# EAGLE design blink1mk3_micro1e (EAGLE 9.1.2)
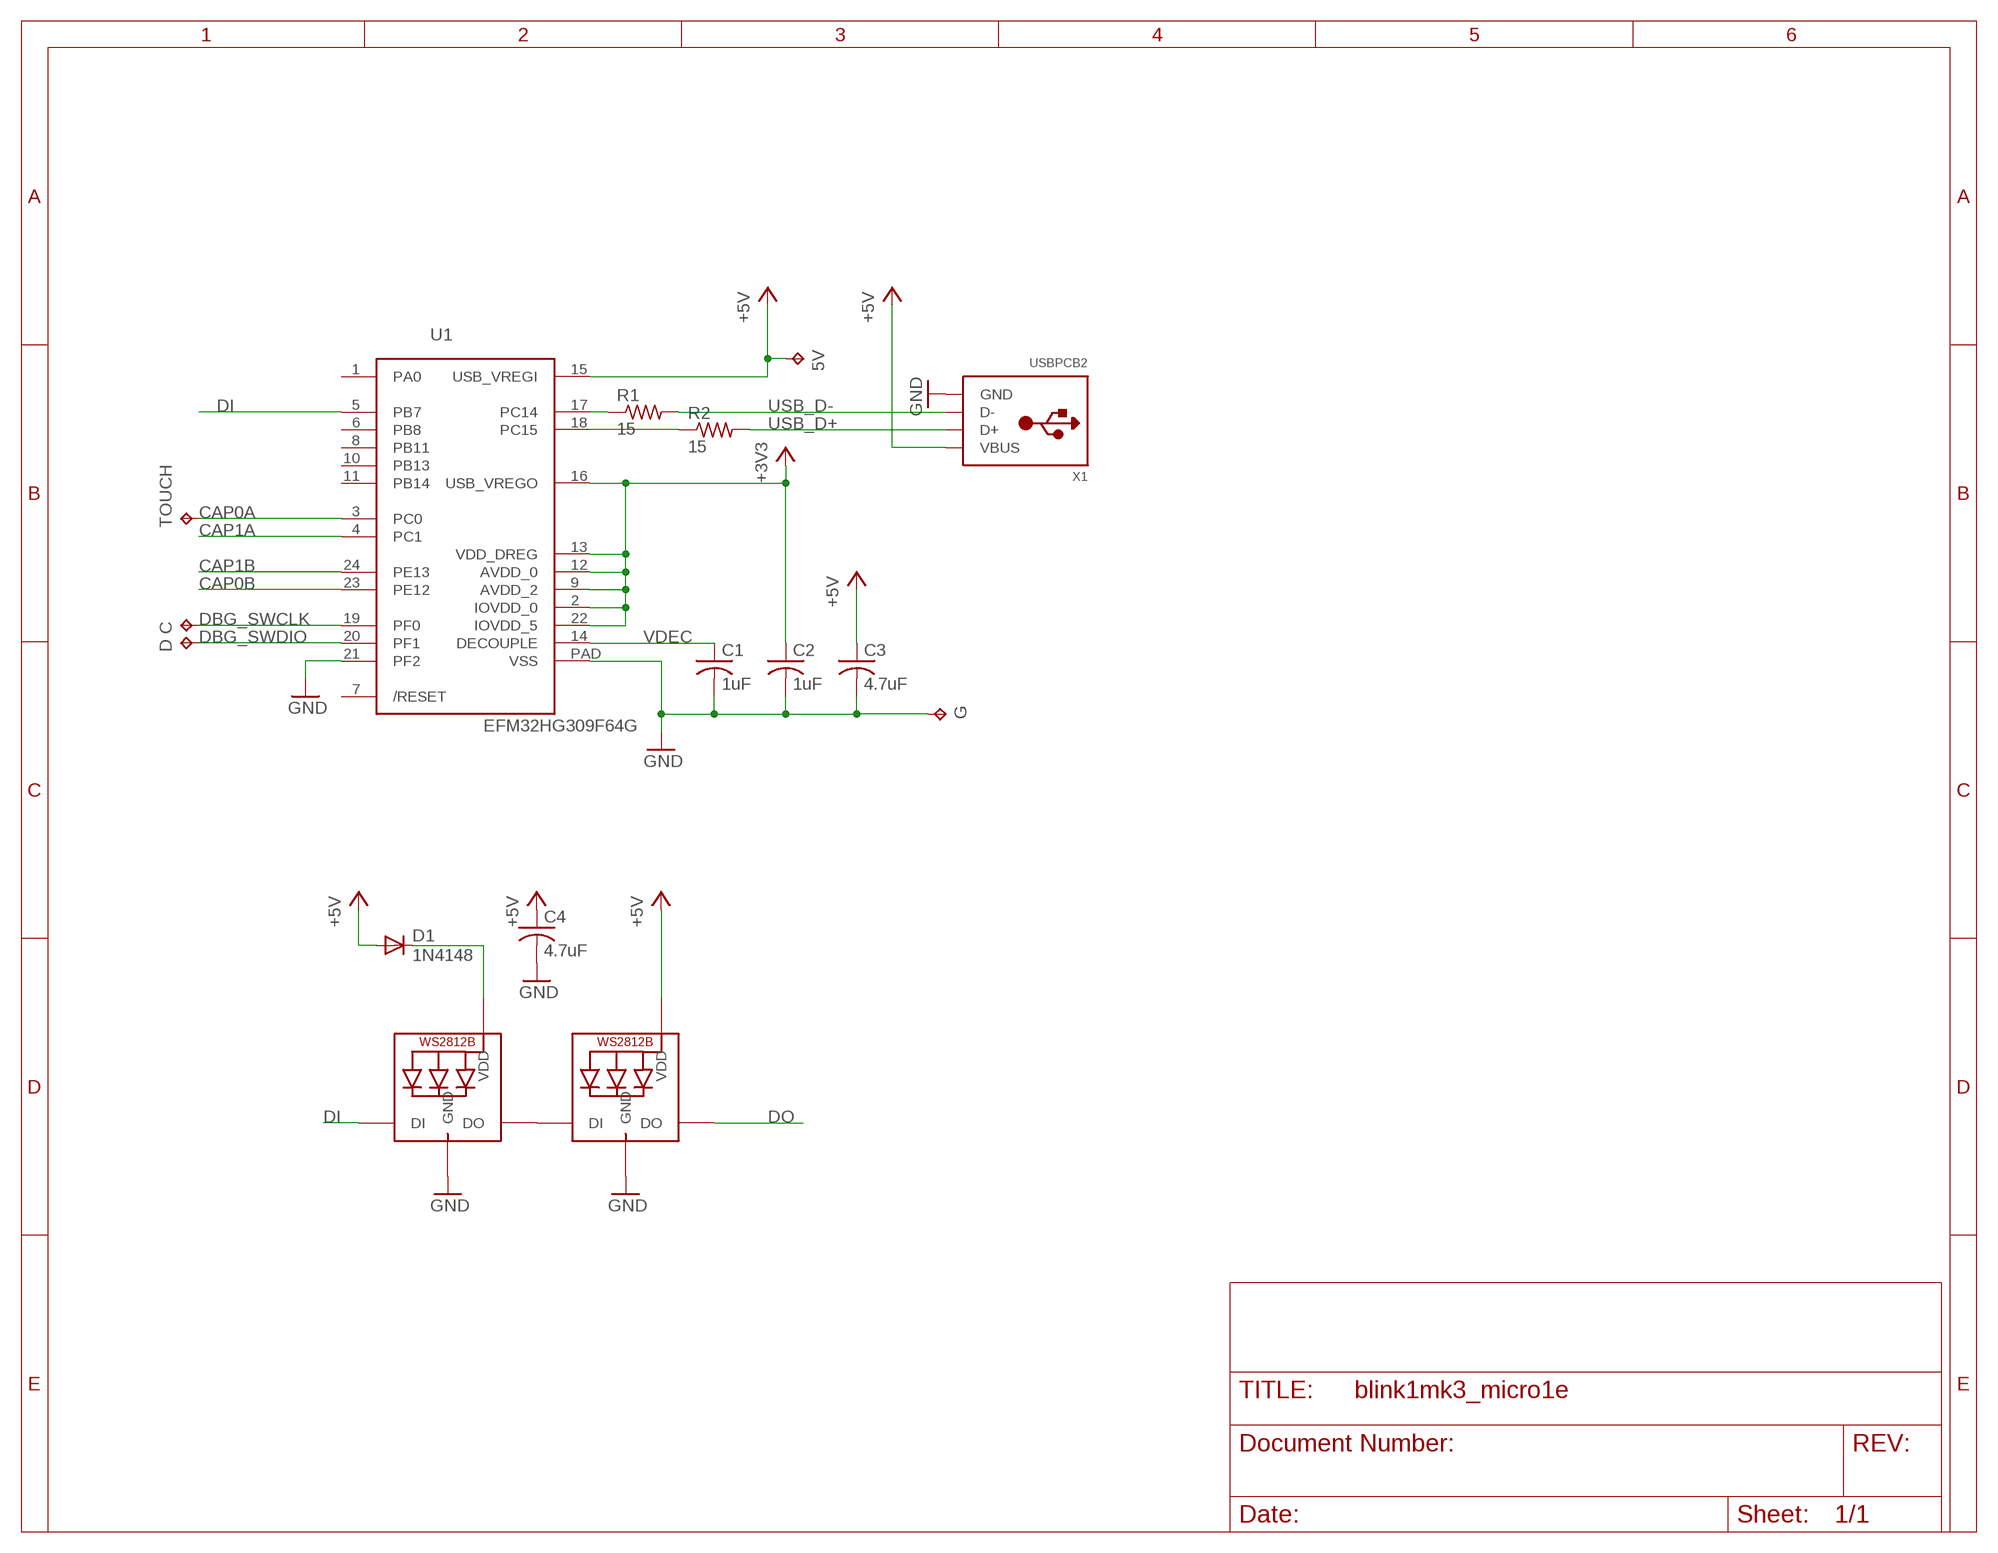
[diagram p0: schematic, sheet 1]

## Parts
5V  TPTP10R  [TP10R]
C  TPTP10R  [TP10R]
C1  1uF  C-USC0402  [C0402]
C2  1uF  C-USC0402  [C0402]
C3  4.7uF  C-USC0402  [C0402]
C4  4.7uF  C-USC0402  [C0402]
D  TPTP10R  [TP10R]
D1  1N4148  DIODE-SOD523  [SOD523]
G  TPTP10SQ  [TP10SQ]
LED1  WS2812B4020SIDE  [SK6812-SIDE]
LED2  WS2812B4020SIDE  [SK6812-SIDE]
R1  15  R-US_R0402  [R0402]
R2  15  R-US_R0402  [R0402]
TOUCH  TPTP10R  [TP10R]
U1  EFM32HG309F64G  [QFN24PAD]
X1  USBPCB2  [USB-A-PCB-2]

## Nets
+3V3: C2.1 U1.2(IOVDD_0) U1.9(AVDD_2) U1.12(AVDD_0) U1.13(VDD_DREG) U1.16(USB_VREGO) U1.22(IOVDD_5)
+5V: 5V.TP C3.1 C4.1 D1.A LED2.1-VDD(VDD) U1.15(USB_VREGI) X1.5V(VBUS)
CAP0A: TOUCH.TP U1.3(PC0)
CAP0B: U1.23(PE12)
CAP1A: U1.4(PC1)
CAP1B: U1.24(PE13)
DBG_SWCLK: C.TP U1.19(PF0)
DBG_SWDIO: D.TP U1.20(PF1)
DI: LED1.4-DIN(DI) U1.5(PB7)
DO: LED2.2-DOUT(DO)
GND: C1.2 C2.2 C3.2 C4.2 G.TP LED1.3-GND(GND) LED2.3-GND(GND) U1.21(PF2) U1.PAD(VSS) X1.GND
N$1: LED1.2-DOUT(DO) LED2.4-DIN(DI)
N$2: R1.1 U1.17(PC14)
N$3: R2.1 U1.18(PC15)
N$5: D1.C LED1.1-VDD(VDD)
USB_D+: R2.2 X1.USB_P(D+)
USB_D-: R1.2 X1.USB_M(D-)
VDEC: C1.1 U1.14(DECOUPLE)
Unconnected: U1.1(PA0) U1.6(PB8) U1.7(/RESET) U1.8(PB11) U1.10(PB13) U1.11(PB14)

## Library data of the parts
5V C D G TOUCH = testpad:TP: Test pad
C1-C4 = rcl:C-US: CAPACITOR, American symbol; SPICEPREFIX: C
D1 = diode:DIODE-: DIODE
LED1 LED2 = todstuff:WS2812B
R1 R2 = adafruit:R-US_: RESISTOR, American symbol
U1 = todstuff:EFM32HG309F64G
X1 = todstuff:USB

## Board
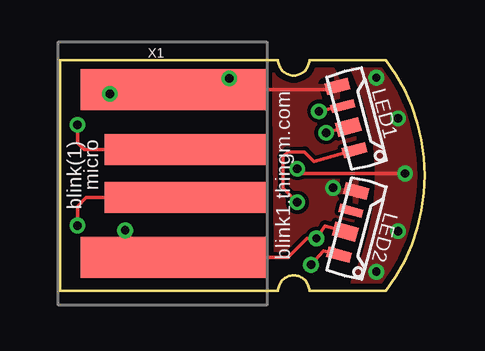
[diagram p1: board, top side]
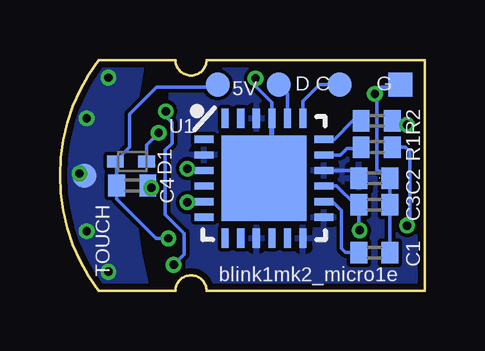
[diagram p2: board, bottom side, seen from below]

Size 15.22 x 9.64 mm. Coordinates in mm from the lower left corner, seen from the top.
Outline: 10.4,0 13.6,0 arc74 13.6,9.64 10.4,9.64 arc-180 9.1,9.64 0,9.64 0,0 9.1,0 arc-180 10.4,0
Copper layers (1*16): Top 0.035mm / dielectric 0.785mm / Bottom 0.035mm
Design rules "SeeedStudio_2layer_DRU_no_angle_20140221_blink1thin": minimum track width 6mil, minimum drill 12mil, track to track 6mil, track to pad 6mil, pad to pad 6mil, via to via 6mil, smd to smd 0mil, copper to edge 10mil, drill to drill 10mil, minimum pad ring 10mil, minimum via ring 6mil, stop-mask expansion 2mil, vias tented up to drill 100mil, thermal gap 10mil

### Footprints (pad centres in the part's own frame; a part is rotated, then mirrored left to right if it is on the bottom)
TP10R = smd 1 x 1: TP 0,0
C0402 = smd 0.7 x 0.9: 1 -0.65,0; 2 0.65,0
SOD523 = smd 0.7 x 0.5: A 0.7,0; C -0.6,0
TP10SQ = smd 1 x 1: TP 0,0
SK6812-SIDE = smd 0.6 x 1: 1-VDD 0.25,-0.45 | smd 0.35 x 1: 2-DOUT -0.65,-0.45 | smd 0.5 x 1: 3-GND -1.5,-0.45 | smd 0.45 x 1: 4-DIN 1.25,-0.45
R0402 = smd 0.7 x 0.9: 1 -0.65,0; 2 0.65,0
QFN24PAD = smd 0.8 x 0.3: 1 -2.5,1.625; 2 -2.5,0.975; 3 -2.5,0.325; 4 -2.5,-0.325; 5 -2.5,-0.975; 6 -2.5,-1.625; 13 2.5,-1.625; 14 2.5,-0.975; 15 2.5,-0.325; 16 2.5,0.325; 17 2.5,0.975; 18 2.5,1.625 | smd 0.3 x 0.8: 7 -1.625,-2.5; 8 -0.975,-2.5; 9 -0.325,-2.5; 10 0.325,-2.5; 11 0.975,-2.5; 12 1.625,-2.5; 19 1.625,2.5; 20 0.975,2.5; 21 0.325,2.5; 22 -0.325,2.5; 23 -0.975,2.5; 24 -1.625,2.5 | smd 3.55 x 3.55: PAD 0,0
USB-A-PCB-2 = smd 7.75 x 1.69: 5V -1.47,-3.5; GND -1.47,3.5 | smd 6.75 x 1.3: USB_M -0.97,-1; USB_P -0.97,1

### Placement (x,y rotation side)
5V  8.64,8.61 0 bottom
C  3.56,8.61 0 bottom
C1  2.1,1.6 0 bottom
C2  2.1,4.7 0 bottom
C3  2.1,3.6 0 bottom
C4  12.2,4.4 0 bottom
D  6.1,8.61 0 bottom
D1  12.2,5.4 180 bottom
G  1.02,8.61 0 bottom
LED1  12.4,7.2 285 top
LED2  12.4,2.6 255 top
R1  2,6 0 bottom
R2  2,7.1 0 bottom
TOUCH  14.2,4.8 270 bottom
U1  6.7,4.7 0 bottom
X1  6.2,4.9 0 top

### Tracks (layer width: path | path; a pad name or v marks a point on that pad's centre or on a via)
+3V3
  Bottom 0.152: U1.16 3.08,5.03 C2.1
  pour Bottom: -0.1,9.65 10.61,9.59 10.71,0 0,0
+5V  (via drill 0.35)
  Top 0.152: v2.72,2.53 3.55,1.4 X1.5V 9.5,1.4 10.29,2.19 v10.7,2.19 11.05,2.72 LED2.1-VDD
  Bottom 0.152: v2.72,2.53 2.75,2.46 C3.1 2.9,3.6 3.67,4.38 U1.15 | 5V.TP 8.74,8.51 11.18,8.51 12.3,7.39 12.3,6 D1.A 12.85,5.35 C4.1 12.85,3.83 11.21,2.19 v10.7,2.19
CAP0A  (via drill 0.35)
  Top 0.152: v9.9,5.1 10.1,4.9 v14.4,4.9
  Bottom 0.152: TOUCH.TP v14.4,4.9 | U1.3 9.82,5.03 v9.9,5.1
  other vias: 13.2,8.9 13.2,0.8 14.1,2.5 14.1,7.2
  pour Bottom (no thermals): 16,9.7 11.7,9.7 arc-27 11.5,-0.1 15.9,-0.1
  pour Top (no thermals): 11.9,9.8 14.5,9.8 arc-71 14.5,-0.2 11.9,-0.2 arc58
DBG_SWCLK
  Bottom 0.152: U1.19 5.08,7.92 4.39,8.61 C.TP
DBG_SWDIO
  Bottom 0.152: D.TP 5.72,8.24 U1.20
DI  (via drill 0.35)
  Top 0.152: LED1.4-DIN 10.6,5.4 10.2,5.8 9.5,5.8 9.3,5.6 9.3,4.3 v9.9,3.7
  Bottom 0.152: U1.5 9.88,3.73 v9.9,3.7
GND  (via drill 0.35)
  Top 0.152: X1.GND 6.67,8.4 v7.06,8.86 | X1.GND 11.45,8.4 LED1.3-GND | X1.GND 4.56,8.23 v2.08,8.23
  Bottom 0.152: C1.2 C3.2 C2.2 2,5.05 2,8.15 v2.08,8.23 1.8,8.51 1.12,8.51 G.TP | C4.2 11.4,4.4 v11.4,4.3 | U1.21 6.38,7.86 7.06,8.54 v7.06,8.86 | U1.PAD 6.38,6.12
  Bottom 0.203: 6.38,6.12 U1.21
  pour Top: 8.9,9.9 11.05,9.9 arc-61 11.05,-0.3 9,-0.3
N$1  (via drill 0.35)
  Top 0.152: LED1.2-DOUT v10.8,7.5 | LED2.4-DIN 11,1.68 v10.47,1.09
  Bottom 0.152: v10.8,7.5 10.8,7.29 10.54,7.03 10.54,6.16 10.82,5.88 10.82,3.2 10.03,2.41 10.03,1.53 v10.47,1.09
N$2
  Bottom 0.152: R1.1 2.7,5.95 3.25,5.95 3.52,5.67 U1.17
N$3
  Bottom 0.152: R2.1 3,7.1 3.77,6.33 U1.18
N$5  (via drill 0.35)
  Top 0.152: LED1.1-VDD v11.1,6.6
  Bottom 0.152: v11.1,6.6 11.6,6.1 D1.C
USB_D+  (via drill 0.35)
  Top 0.152: v0.73,6.93 0.73,6.17 1,5.9 X1.USB_P
  Bottom 0.152: R2.2 0.91,7.1 v0.73,6.93
USB_D-  (via drill 0.35)
  Top 0.152: X1.USB_M 1.1,3.9 0.73,3.53 v0.73,2.73
  Bottom 0.152: R1.2 0.8,6 0.63,5.83 0.63,2.75 v0.73,2.73
VDEC
  Bottom 0.152: C1.1 3.3,1.6 3.48,1.77 3.48,3.36 3.84,3.73 U1.14

### Text on the board
tPlace: micro | blink(1) | blink1.thingm.com
bPlace: blink1mk2_micro1e